# Altium schematic sheet PowerMgt.SchDoc
size A4; Organization: Altium Limited; Address1: L3, 12a Rodborough Rd; Address2: Frenchs Forest; Address3: NSW; Address4: Australia 2086; DocumentNumber: 2; SheetNumber: 2; SheetTotal: 5
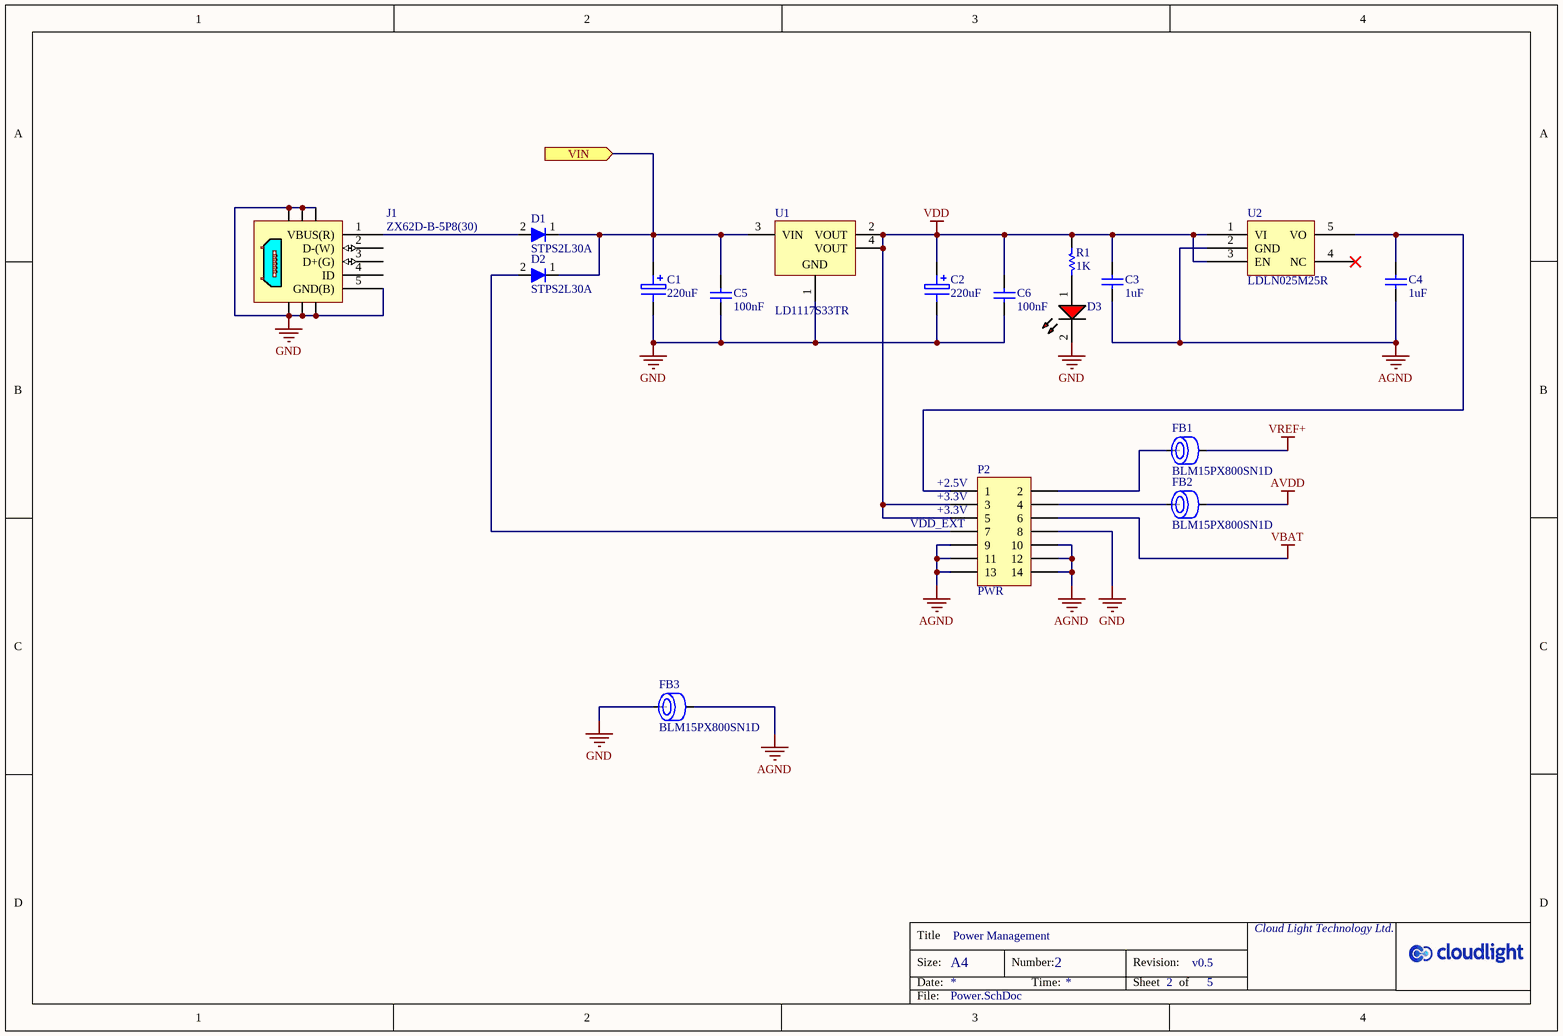
[diagram p0: PowerMgt.SchDoc]

## Parts
C1  220uF  [SMD-EC-F6.3]
C2  220uF  [SMD-EC-F6.3]
C3  1uF  [CAPC1608N]
C4  1uF  [CAPC1608N]
C5  100nF  [CAPC1608N]
C6  100nF  [CAPC1608N]
D1  STPS2L30A  [DIOM4326X25N]
D2  STPS2L30A  [DIOM4326X25N]
D3  LED-SMD0603-R  [CD1608-0603]  (value not drawn)
FB1  BLM15PX800SN1D  [FBC1005N]
FB2  BLM15PX800SN1D  [FBC1005N]
FB3  BLM15PX800SN1D  [FBC1005N]
J1  ZX62D-B-5P8(30)  [USB2.0-4H5]
P2  PWR  [HDR2X7]
R1  1K  [RESC1608N]
U1  LD1117S33TR  [SOT-223_N]
U2  LDLN025M25R  [SOT95P280X145-5N]

## Ports
VIN

## Nets
AGND: C3.1 C4.1 FB3.2 P2.9 P2.10 P2.11 P2.12 P2.13 P2.14 U2.2(GND)
AVDD: FB2.2
GND: C1.2 C2.2 C5.1 C6.1 D3.2(RK) FB3.1 J1.5(GND(B)) J1.6 J1.7 J1.8 J1.9 J1.10 J1.11 P2.8 U1.1(GND)
VBAT: P2.6
VDD: C2.1 C3.2 C6.2 P2.3 P2.5 R1.1 U1.2(VOUT) U1.4(VOUT) U2.1(VI) U2.3(EN)
VREF+: FB1.2
VIN: C1.1 C5.2 D1.1(K) D2.1(K) U1.3(VIN) ; port VIN
NetC4_2: C4.2 P2.1 U2.5(VO)
NetD1_2: D1.2(A) J1.1(VBUS(R))
NetD2_2: D2.2(A) P2.7
NetD3_1: D3.1(RA) R1.2
NetFB1_1: FB1.1 P2.2
NetFB2_1: FB2.1 P2.4

Not connected (* = marked no-connect by the designer): J1 2(D-(W)) 3(D+(G)) 4(ID); U2 4(NC)*

## Notes on the sheet
- (near P2) +2.5V
- (near P2) +3.3V
- (near P2) VDD_EXT
- Title
- Size:
- Date:
- A4
- Power Management
- Number:
- Time:
- Revision:
- Sheet
- 2
- of
- v0.5
- 5
- Cloud Light Technology Ltd.
- File:
- Power.SchDoc

## Library data of the parts
C1 C2 = EEE-FPC221XAP: 220μF 16V Aluminum Electrolytic Capacitors Radial, Can - SMD 160 mohm @ 100kHz 2000 Hrs @ 105°C; Manufacturer: Panasonic Electronic Components; Package: SMD-EC-F6.3; PackageDescription: SMD Aluminum Electrolytic Capacitors, Dia 6.3mm, Height 7.7mm; PartNumber: EEE-FPC221XAP; Supplier 1: Digi-Key; Supplier Part Number 1: PCE4537CT-ND; Value: 220uF
C3 C4 = Chip Capacitor: Manufacturer: [N/A]; Value: 1uF/16V/X7R/±20%; Revision: V1.0.0; Package: 0603; PackageDescription: 0603 Chip Capacitor; PartNumber: [N/A]; Supplier 1: [N/A]; Supplier Part Number 1: [N/A]; Publisher: Wentao SUN; Published: 16-Apr-2019
C5 C6 = Chip Capacitor: Manufacturer: [N/A]; Value: 100nF/16V/X7R/±10%; Revision: V1.0.0; Package: 0603; PackageDescription: 0603 Chip Capacitor; PartNumber: [N/A]; Supplier 1: [N/A]; Supplier Part Number 1: [N/A]; Publisher: Wentao SUN; Published: 16-Apr-2019
D1 D2 = STPS2L30A: Diode Schottky 30V 2A Surface Mount SMA; Manufacturer: STMicroelectronics; PartNumber: STPS2L30A; Package: DO-214AC, SMA; Supplier 1: Digi-Key; Supplier Part Number 1: 497-3759-1-ND; PackageDescription: Molded Diode, 2-Leads, Body 4.27x2.57mm; ComponentLink1Description: Digi-Key; ComponentLink1URL: https://www.digikey.com/products/en?keywords=497-3759-2-ND; Publisher: Wentao SUN; Published: 18-Apr-2019
D3 = LED-SMD0603-R: Single Color LED Indication, 0603, Red; Manufacturer: [N/A]; ComponentLink1Description: [N/A]; ComponentLink1URL: [N/A]; Package: 0603; PackageDescription: Chip Diode; Body 1.6 x 0.8 mm (LxW typ); PartNumber: [N/A]; Published: 21-Apr-2019; Publisher: Wentao SUN; Supplier 1: [N/A]; Supplier Part Number 1: [N/A]
FB1-FB3 = Ferrite Bead: 80 Ohms @ 100MHz 1 Power Line Ferrite Bead 0402 (1005 Metric) 2.3A 38mOhm; Manufacturer: Murata Electronics North America; Published: 16-Apr-2019; Revision: V1.0.0; Publisher: Wentao SUN; Package: 0402; PackageDescription: Chip Ferrite Bead Body 1.1x0.5mm; PartNumber: BLM15PX800SN1D; Supplier 1: Digi-Key; Supplier Part Number 1: 490-10663-1-ND
J1 = ZX62D-B-5P8(30): USB - micro B USB 2.0 Receptacle Connector 5-Pin; Manufacturer: Hirose Electric Co Ltd; PartNumber: ZX62D-B-5P8(30); Package: USB2.0-4H5; PackageDescription: USB Micro B, 0.65mm Pitch, 4 holes; Supplier 1: Digi-Key; Supplier Part Number 1: H125272CT-ND; ComponentLink1URL: https://www.digikey.com/products/en?keywords=H125272TR-ND; ComponentLink1Description: Digi-Key
P2 = Header 7X2: Header, 7-Pin, Dual row; Manufacturer: [N/A]; LatestRevisionDate: 17-Jul-2002; LatestRevisionNote: Re-released for DXP Platform.; Publisher: Altium Limited; PartNumber: [N/A]; Package: HDR2X7/T2.54/B2B; PackageDescription: Connector; Header; 2X7 Position; Pitch 2.54mm; Style Board to Board;; Supplier 1: [N/A]; Supplier Part Number 1: [N/A]
R1 = Chip Resistor: Manufacturer: [N/A]; Value: 1K/±5%/0.1W; Published: 16-Apr-2019; Revision: V1.0.0; Publisher: Wentao SUN; Package: 0603; PackageDescription: 0603 Chip Resistor; PartNumber: [N/A]; Supplier 1: [N/A]; Supplier Part Number 1: [N/A]
U1 = LD1117S33TR: Fixed Low Drop Positive Voltage Regulator, 3.3V, 4-Pin SOT-223, Tape and Reel; Manufacturer: STMicroelectronics; DatasheetVersion: Nov-2011; PackageVersion: 2010; PackageReference: SOT-223; PackageDescription: 4-Pin SOT-223 Package, 6.5 x 3.5 mm Body, 2.3 mm Pitch, 7 mm Lead Span; PartNumber: LD1117S33TR; ComponentLink1Description: Manufacturer URL; ComponentLink1URL: http://www.st.com; ComponentLink2Description: Datasheet; ComponentLink2URL: http://www.st.com/internet/com/TECHNICAL_RESOURCES/TECHNICAL_LITERATURE/DATASHEET/CD00000544.pdf; Package: SOT-223; Supplier 1: Digi-Key; Supplier Part Number 1: 497-1242-1-ND
U2 = LDLN025M25R: Linear Voltage Regulator IC  1 Output  250mA SOT-23-5; Manufacturer: STMicroelectronics; PartNumber: LDLN025M25R; PackageDescription: Small Outine Transistor 5 Leads; Supplier 1: Digi-Key; Supplier Part Number 1: 497-17805-1-ND; Package: SOT-23-5L